# Altium schematic sheet ALU_Reg.SchDoc
size B; Author: E. Sims; Organization: Let's Build Rockets Inc.; SheetNumber: 3; SheetTotal: 3
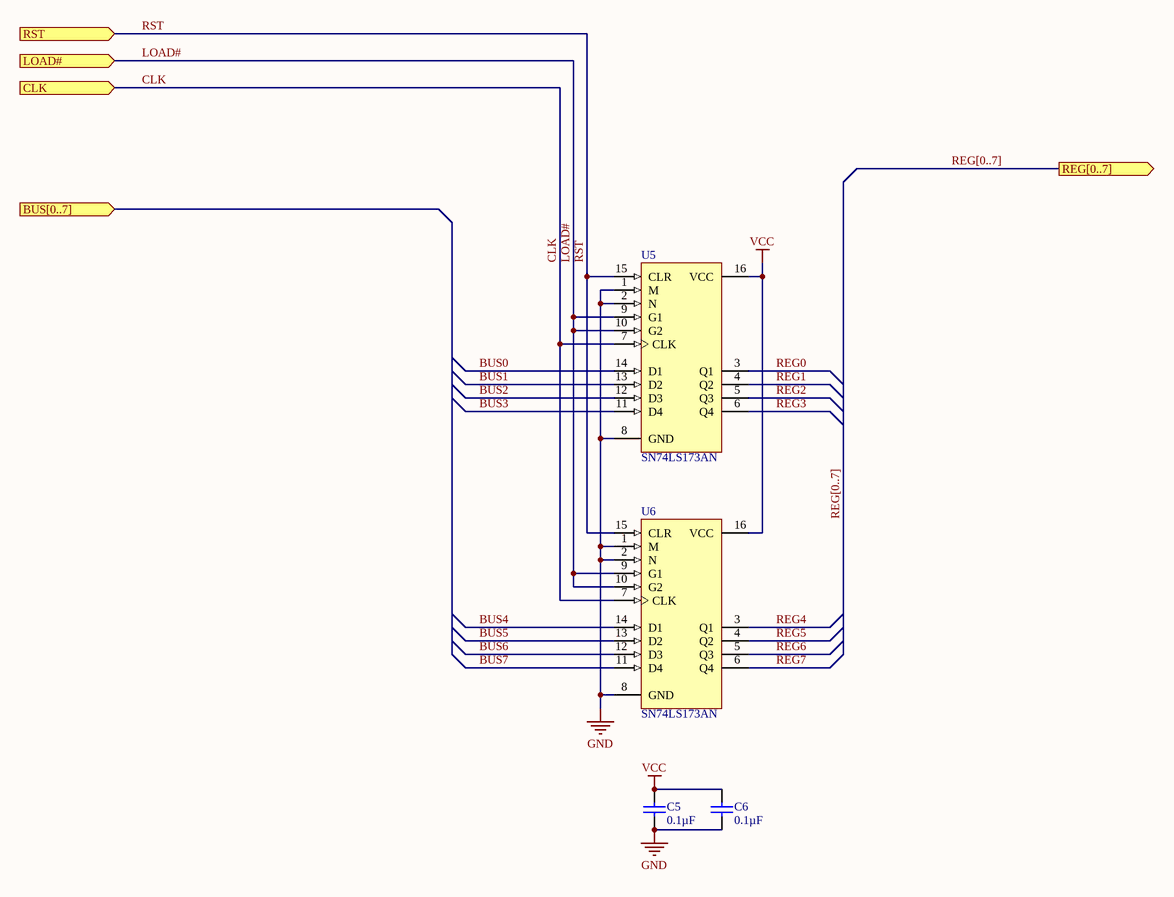
[diagram p0: ALU_Reg.SchDoc]

## Parts
C5  Capacitance: 0.1µF  [VISH-K104K15X7RF5TL2]  (hidden comment: K104K15X7RF5TL2)
C6  Capacitance: 0.1µF  [VISH-K104K15X7RF5TL2]  (hidden comment: K104K15X7RF5TL2)
U5  SN74LS173AN  [N016D]
U6  SN74LS173AN  [N016D]

## Ports
BUS[0..7] (in), CLK (in), LOAD# (in), REG[0..7] (out), RST (in)

## Nets
GND: C5.2 C6.2 U5.1(M) U5.2(N) U5.8(GND) U6.1(M) U6.2(N) U6.8(GND)
VCC: C5.1 C6.1 U5.16(VCC) U6.16(VCC)
BUS0: U5.14(D1)
BUS1: U5.13(D2)
BUS2: U5.12(D3)
BUS3: U5.11(D4)
BUS4: U6.14(D1)
BUS5: U6.13(D2)
BUS6: U6.12(D3)
BUS7: U6.11(D4)
CLK: U5.7(CLK) U6.7(CLK) ; port CLK
LOAD#: U5.9(G1) U5.10(G2) U6.9(G1) U6.10(G2) ; port LOAD#
REG0: U5.3(Q1)
REG1: U5.4(Q2)
REG2: U5.5(Q3)
REG3: U5.6(Q4)
REG4: U6.3(Q1)
REG5: U6.4(Q2)
REG6: U6.5(Q3)
REG7: U6.6(Q4)
RST: U5.15(CLR) U6.15(CLR) ; port RST

## Buses and harness runs
bus REG[0..7] = port REG[0..7]

## Notes on the sheet
- Let's Build Rocket's Inc. Modular Paylaod System Based on TMP-010 Rev
  For more information visit https://github.com/LetsBuildRockets/Modular-Payload-System
  This work is licensed under CC BY-NC 4.0. To view a copy of this license, visit https://creativecommons.org/licenses/by-nc/4.0
- Title
- Size:
- Date:
- Assembly Variant:
- B
- Number:
- Time:
- Revision:
- Sheet
- of
- Author:
- File:

## Library data of the parts
C5 C6 = CMP-2000-06508-1: Ceramic Capacitor, 100 nF, +/- 10%, 50 V, -55 to 125 degC, 2-Pin THD, RoHS, Tape and Reel; Manufacturer: Vishay; Other Names: BC1084CT; Catalog Drawings: Mono-KapSide2-15_5.58Mono-KapSide1_15; Temperature Coefficient: X7R; Voltage - Rated: 50V; Online Catalog: Mono-Kap™Series; Size / Dimension: 0.157"Lx0.098"W(4.00mmx2.50mm); Operating Temperature: -55°C~125°C; Family: CeramicCapacitors; Manufacturer URL: http://www.vishay.com/; Standard Package: 1; Thickness (Max): -; Ratings: -; Datasheet Version: 08/2013; Package Description: 2-Pin Through Hole Device, Body 4 x 2.6 mm; Mounting Type: ThroughHole; Features: -; Lead Spacing: 0.098"(2.50mm); Tolerance: ±10%; Category: Capacitors; Mounting Technology: ThroughHole; Lead Style: Straight; Datasheet URL: http://www.vishay.com/docs/45171/kseries.pdf; Applications: GeneralPurpose; Package / Case: Radial; Height - Seated (Max): 0.220"(5.58mm); Package Reference: K104K15X7RF5TL2; Series: Mono-Kap™K; Packaging: CutTape(CT)
U5 U6 = SN74LS173AN: 4-Bit D-Type Register with 3-State Outputs; Published: 8-Jun-2000; LatestRevisionDate: 04-Mar-2005; LatestRevisionNote: Stylized 3D Model Added.; DatasheetVersion: Mar-1988; PackageVersion: Oct-1995; PackageReference: N016D; Publisher: Altium Limited; PackageDescription: DIP; 16 Leads; Row Spacing 7.62 mm; Pitch 2.54 mm; Code_JEDEC: MS-001-BB; ComponentLink1Description: Manufacturer Link; ComponentLink1URL: http://www.ti.com/; ComponentLink2Description: Datasheet; ComponentLink2URL: http://www-s.ti.com/sc/ds/sn74ls173a.pdf